# EAGLE design tweeq-eMod_LEDPB (EAGLE 7.2.0)
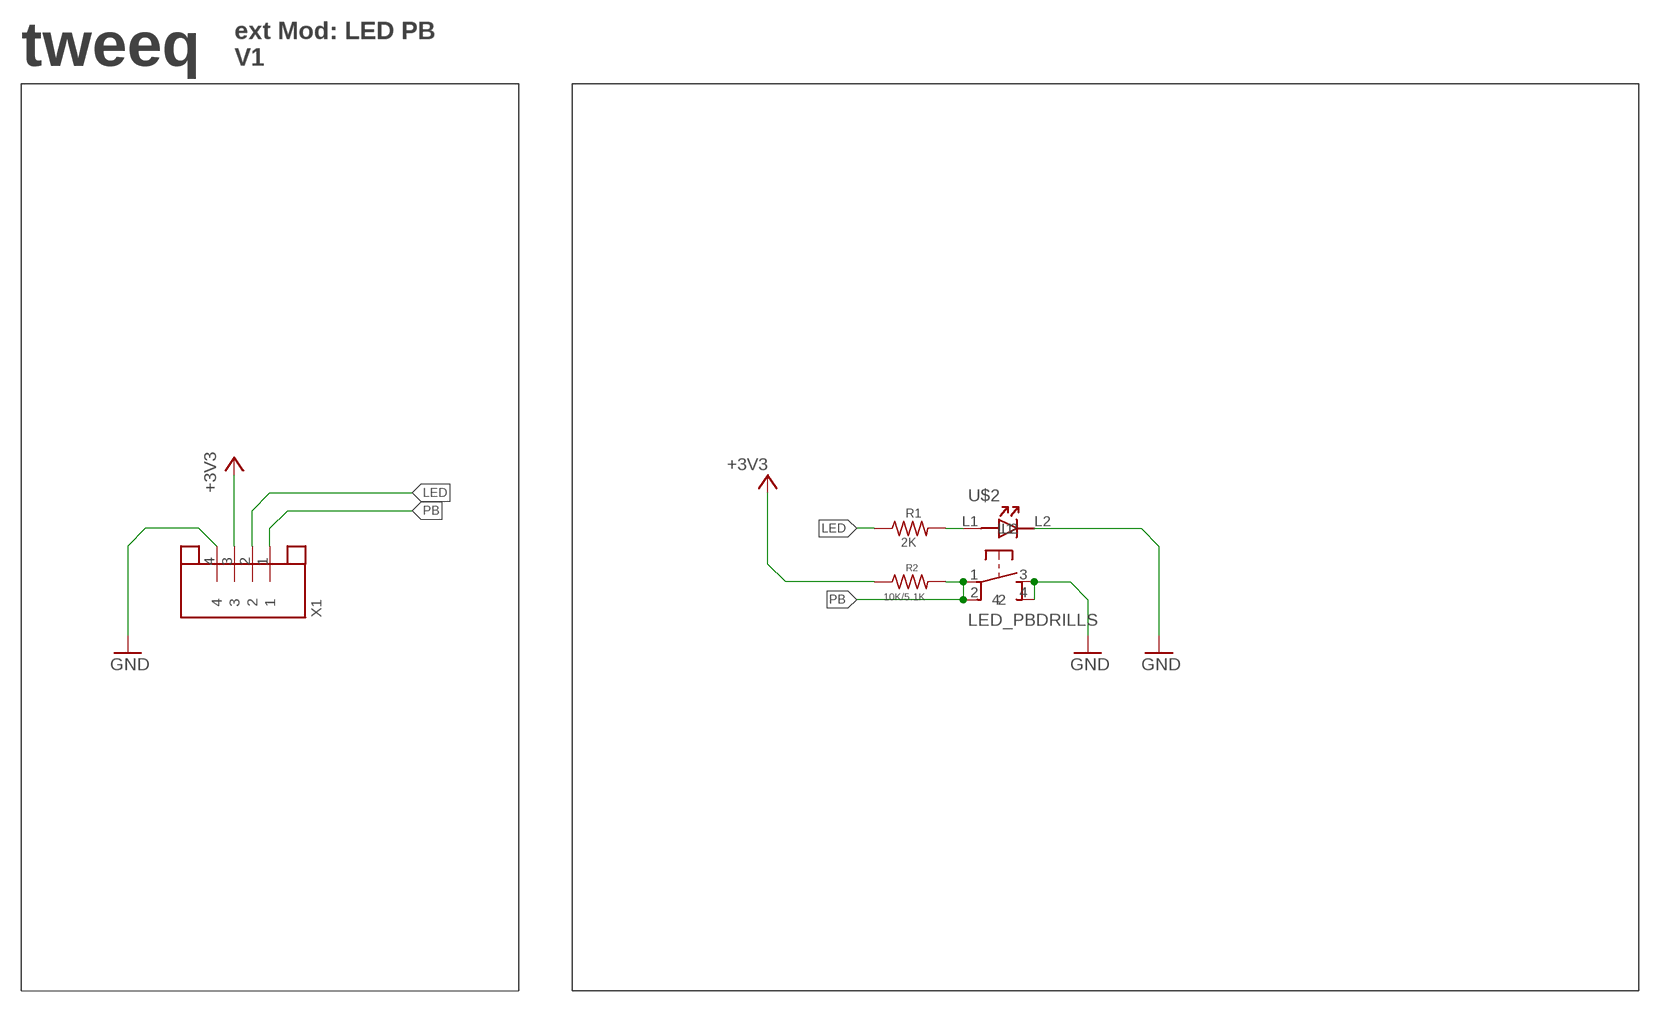
[diagram p0: schematic, sheet 1]

## Parts
R1  2K  R-US_R0603  [R0603]
R2  10K/5.1K  R-US_R0603  [R0603]
U$2  LED_PBDRILLS  [LED_PB_12X12_SMD_HOLES]
X1  JST-4PINSH  [SH1.0-4PIN]

## Nets
+3V3: R2.1 X1.3
GND: U$2.3 U$2.4 U$2.L2 X1.4
LED: R1.1 X1.2
N$2: R1.2 U$2.L1
PB: R2.2 U$2.1 U$2.2 X1.1

## Notes on the sheet
- tweeq
- ext Mod: LED PB
  V1

## Library data of the parts
R1 R2 = rcl:R-US_: RESISTOR, American symbol
U$2 = AISCube:LED_PB: LED Pushbutton
X1 = AISCube:JST-4PIN: JST 4 Pin

## Board
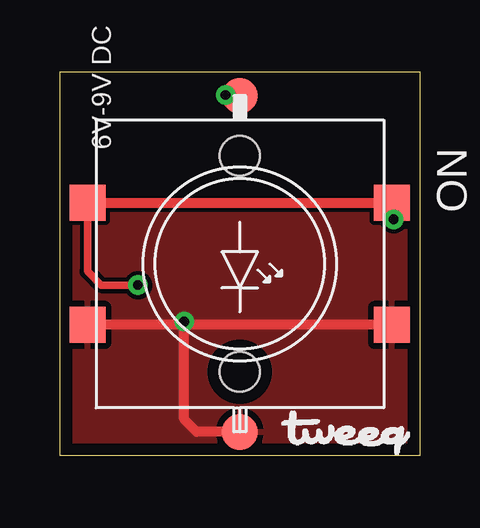
[diagram p1: board, top side]
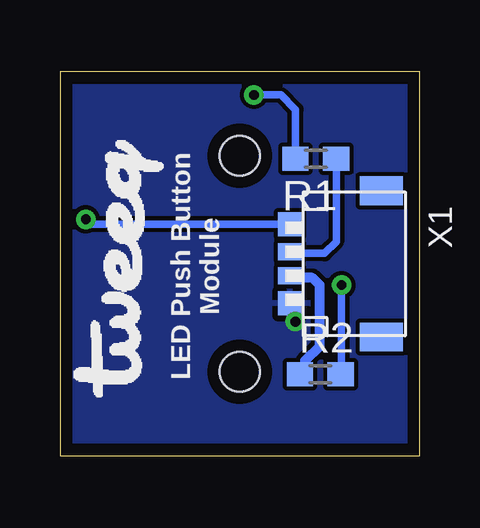
[diagram p2: board, bottom side, seen from below]

Size 15 x 16 mm. Coordinates in mm from the lower left corner, seen from the top.
Outline: 0,16 15,16 15,0 0,0 0,16
Copper layers (1*16): Top 0.0356mm / dielectric 1.5011mm / Bottom 0.0356mm
Design rules "AISCube": minimum track width 7mil, minimum drill 14mil, track to track 7mil, track to pad 7mil, pad to pad 7mil, via to via 7mil, smd to smd 0mil, copper to edge 20mil, drill to drill 8mil, minimum pad ring 10mil, minimum via ring 8mil, stop-mask expansion 4mil, vias tented up to drill 32mil, thermal gap 10mil

### Footprints (pad centres in the part's own frame; a part is rotated, then mirrored left to right if it is on the bottom)
R0603 = smd 1.1 x 1: 1 -0.85,0; 2 0.85,0
LED_PB_12X12_SMD_HOLES = smd 1.5 x 1.5: 1 -6.35,2.54; 2 6.35,2.54; 3 -6.35,-2.54; 4 6.35,-2.54; L1 0,7; L2 0,-7 | hole 1.651: 0,4.5; 0,-4.5
SH1.0-4PIN = smd 1 x 1: 1 -1.65,-0.55; 4 1.65,-0.55 | smd 0.7 x 1: 2 -0.5,-0.55; 3 0.5,-0.55 | smd 1.2 x 1.8: P$1 -3.05,3.25; P$2 3.05,3.25

### Placement (x,y rotation side)
R1  4.33,12.38 180 bottom
R2  4.14,3.4 0 bottom
U$2  7.5,8 0 top
U$4  [TWEEQ-LOGO-S]  9.25,0 0 top
U$5  [TWEEQ-LOGO-L]  10.67,2.44 90 bottom
X1  4.85,8 270 bottom

### Tracks (layer width: path | path; a pad name or v marks a point on that pad's centre or on a via)
+3V3
  Bottom 0.406: X1.3 5.11,7.42 4.47,7.42 4.17,7.11 4.17,4.57 4.78,3.96 4.78,3.61 R2.1
GND  (via drill 0.41)
  Top 0.305: U$2.3 5.05,5.46 v5.18,5.59
  Top 0.406: U$2.L2 5.71,1 5.18,1.52 v5.18,5.59 | U$2.4 U$2.3
  Bottom 0.305: v5.18,5.59 5.18,6.34 X1.4
  pour Top: 14.8,16 14.8,0.18 0.15,0.18 0.15,16
  pour Bottom: 14.8,0.18 14.8,16 0.15,16 0.15,0.18
LED
  Bottom 0.305: R1.1 3.48,8.92 3.96,8.43 5.13,8.43
  Bottom 0.406: 5.13,8.43 X1.2
N$2  (via drill 0.41)
  Top 0.406: v6.91,15.04 7.46,15.04 U$2.L1
  Bottom 0.305: R1.2 5.18,14.42 5.79,15.04 v6.91,15.04
PB  (via drill 0.41)
  Top 0.305: v13.92,9.86 13.92,10.47 U$2.2 | v3.25,7.11 1.73,7.11 1.15,7.69 U$2.1
  Top 0.406: U$2.1 U$2.2
  Bottom 0.305: X1.1 13.71,9.65 v13.92,9.86 | v3.25,7.11 3.25,3.44 R2.2

### Text on the board
bPlace: LED Push Button / Module
tNames: 6V-9V DC | ON
bNames: Breadboard | V-Reg | Module